# EAGLE design ESP12 Altherma (EAGLE 9.6.2)
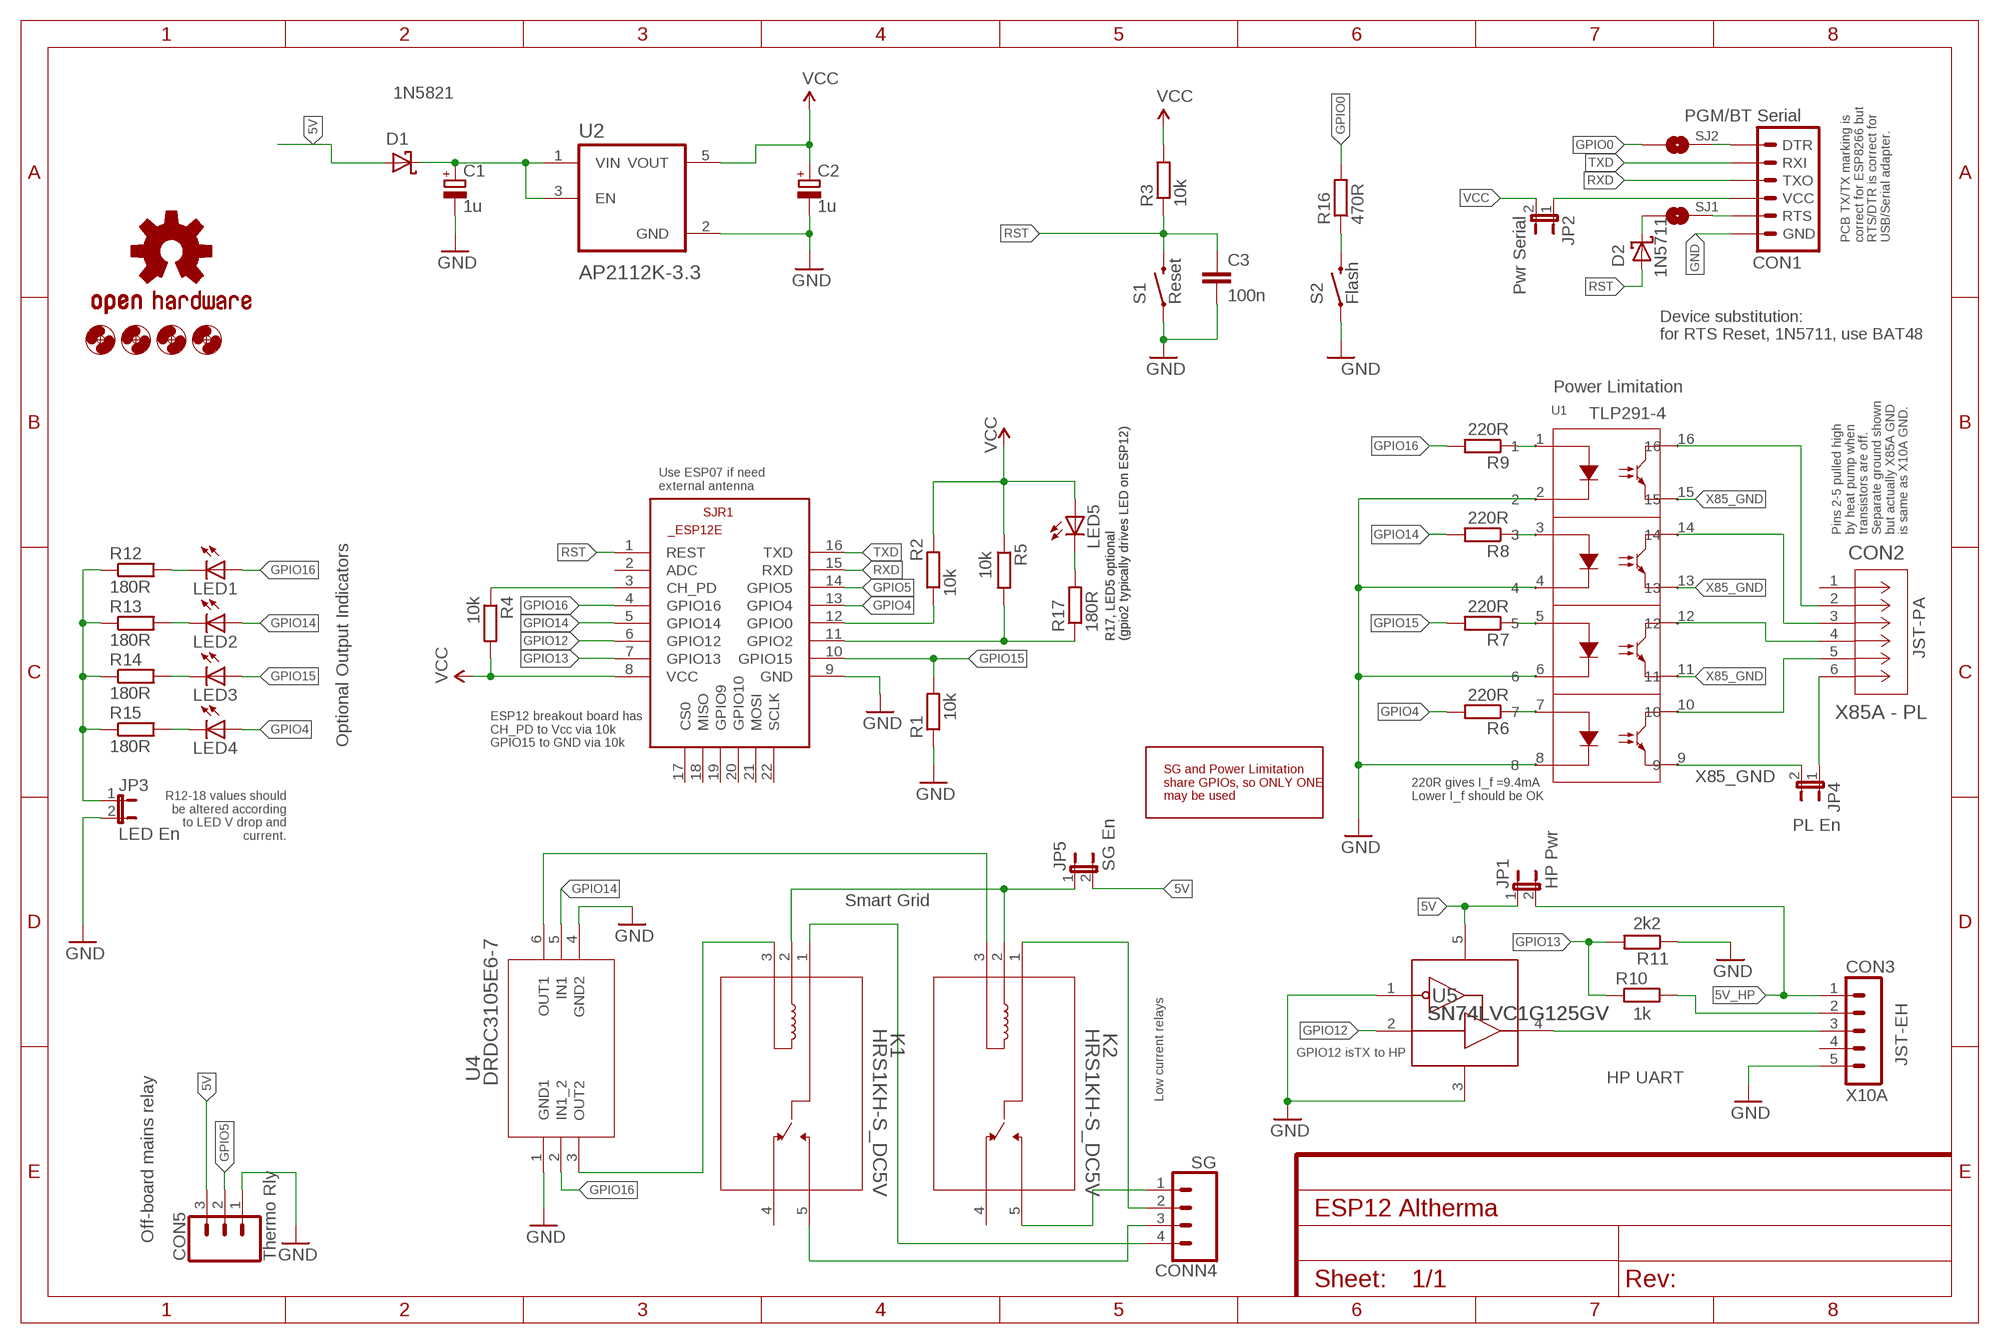
[diagram p0: schematic, sheet 1]

## Parts
C1  1u  CPOL-EUE2.5-5**10UF  [E2,5-5]
C2  1u  CPOL-EUE2.5-5**10UF  [E2,5-5]
C3  100n  C-EU1206  [1206]
CON1  PGM/BT Serial  ESP8266_SERIAL_PROGRAM1X06_ESP_SERIAL  [1X06-KIT]
CON2  X85A - PL  B06B-PASK(LF)(SN)  [CONN_B06B-PASK_JST]
CON3  X10A  B5B-EH-A  [B5B-EH-A]
CON5  Thermo Rly  CONN_03  [1X03]
CONN4  SG  CONN_04PTH  [1X04]
D1  1N5821  DIODE-SCHOTTKYDO-201-VERT  [DO201-15]
D2  1N5711  DIODE-SCHOTTKYDO35-7  [DO35-7]
H1  MOUNT-HOLE3.2  [3,2]
H2  MOUNT-HOLE3.2  [3,2]
H3  MOUNT-HOLE3.2  [3,2]
H4  MOUNT-HOLE3.2  [3,2]
JP1  HP Pwr  JUMPER-2PTH  [1X02]
JP2  Pwr Serial  JUMPER-2PTH  [1X02]
JP3  LED En  JUMPER-2PTH  [1X02]
JP4  PL En  JUMPER-2PTH  [1X02]
JP5  SG En  JUMPER-2PTH  [1X02]
K1  HRS1KH-S_DC5V  [HRS1KH-S_DC5V_MTC]
K2  HRS1KH-S_DC5V  [HRS1KH-S_DC5V_MTC]
LED1  LED1206  [LED-1206]
LED2  LED1206  [LED-1206]
LED3  LED1206  [LED-1206]
LED4  LED1206  [LED-1206]
LED5  LED1206  [LED-1206]
LOGO1  OSHW-LOGOM  [OSHW-LOGO-M]
R1  10k  R-EU_  [1206]
R2  10k  R-EU_  [1206]
R3  10k  R-EU_  [1206]
R4  10k  R-EU_  [1206]
R5  10k  R-EU_  [1206]
R6  220R  R-EU_  [1206]
R7  220R  R-EU_  [1206]
R8  220R  R-EU_  [1206]
R9  220R  R-EU_  [1206]
R10  1k  R-EU_  [1206]
R11  2k2  R-EU_  [1206]
R12  180R  R-EU_  [1206]
R13  180R  R-EU_  [1206]
R14  180R  R-EU_  [1206]
R15  180R  R-EU_  [1206]
R16  470R  R-EU_0204/7**  [0204/7]
R17  180R  R-EU_  [1206]
S1  Reset  SWITCH-MOMENTARY-2PTH  [TACTILE-PTH]
S2  Flash  SWITCH-MOMENTARY-2PTH  [TACTILE-PTH]
SJ1  SOLDERJUMPERTRACE  [SJ_2S-TRACE]
SJ2  SOLDERJUMPERTRACE  [SJ_2S-TRACE]
SJR1  ESP8266-12EESP8266-ESP12E-X  [ESP8266-ESP12E0-NKE]
U1  TLP291-4  TLP291-4(GB-TP,E)  [SO16_TOS]
U2  AP2112K-3.3  AP2112K-3.3TRG1  [SOT95P285X140-5N]
U4  DRDC3105E6-7  DRDC3105E6-7SOT26-DI_DIO-M  [SOT26-DI_DIO-M]
U5  SN74LVC1G125GV  SN74LVC1G125DBVRDBV0005A_L  [DBV0005A_L]

## Nets
5V: CON5.3 D1.A JP1.1 JP5.2 U5.5(VCC)
5V_HP: CON3.1 JP1.2
GND: C1.- C2.- C3.2 CON1.1(GND) CON3.5 CON5.1 JP3.2 R1.1 R11.1 S1.1 S2.1 SJR1.9(GND) U1.2 U1.4 U1.6 U1.8 U2.2(GND) U4.1(GND1) U4.4(GND2) U5.1(OE_N) U5.3(GND)
GPIO0: R2.1 R16.2 SJ2.1 SJR1.12(GPIO0)
GPIO2: R5.2 R17.1 SJR1.11(GPIO2)
GPIO4: LED4.A R6.2 SJR1.13(GPIO4)
GPIO5: CON5.2 SJR1.14(GPIO5)
GPIO12: SJR1.6(GPIO12) U5.2(A)
GPIO13: R10.1 R11.2 SJR1.7(GPIO13)
GPIO14: LED2.A R8.2 SJR1.5(GPIO14) U4.5(IN1)
GPIO15: LED3.A R1.2 R7.2 SJR1.10(GPIO15)
GPIO16: LED1.A R9.2 SJR1.4(GPIO16) U4.2(IN1_2)
N$1: R16.1 S2.3
N$2: R9.1 U1.1
N$3: CON2.3 U1.14
N$4: JP3.1 R12.1 R13.1 R14.1 R15.1
N$5: CON1.2(RTS) SJ1.2
N$6: JP5.1 K1.2 K2.2
N$7: LED3.C R14.2
N$8: C1.+ D1.C U2.1(VIN) U2.3(EN)
N$9: CON1.3(VCC) JP2.1
N$10: CON1.6(DTR) SJ2.2
N$11: CON2.5 U1.10
N$12: CON2.4 U1.12
N$13: CON2.2 U1.16
N$14: D2.C SJ1.1
N$15: LED4.C R15.2
N$16: R4.1 SJR1.3(CH_PD)
N$17: R6.1 U1.7
N$18: R8.1 U1.3
N$19: R7.1 U1.5
N$20: CON3.3 U5.4(Y)
N$21: CON3.2 R10.2
N$22: CONN4.1 K2.5
N$23: CONN4.2 K2.1
N$24: CONN4.3 K1.5
N$25: CONN4.4 K1.1
N$26: K1.3 U4.3(OUT2)
N$27: CON2.6 JP4.1
N$28: LED5.C R17.2
N$29: K2.3 U4.6(OUT1)
N$39: LED1.C R12.2
N$40: LED2.C R13.2
RST: C3.1 D2.A R3.1 S1.3 SJR1.1(REST)
RXD: CON1.4(TXO) SJR1.15(RXD)
TXD: CON1.5(RXI) SJR1.16(TXD)
VCC: C2.+ JP2.2 LED5.A R2.2 R3.2 R4.2 R5.1 SJR1.8(VCC) U2.5(VOUT)
X85_GND: JP4.2 U1.9 U1.11 U1.13 U1.15
Unconnected: CON2.1 CON3.4 K1.4 K2.4 SJR1.2(ADC) SJR1.17(CS0) SJR1.18(MISO) SJR1.19(GPIO9) SJR1.20(GPIO10) SJR1.21(MOSI) SJR1.22(SCLK)

## Notes on the sheet
- PCB TX/TX marking is
  correct for ESP8266 but
  RTS/DTR is correct for
  USB/Serial adapter.
- Device substitution:
  for RTS Reset, 1N5711, use BAT48
- Power Limitation
- TLP291-4
- Use ESP07 if need
  external antenna
- Pins 2-5 pulled high
  by heat pump when
  transistors are off.
  Separate ground shown
  but actually X85A GND
  is same as X10A GND.
- R17, LED5 optional
  (gpio2 typically drives LED on ESP12)
- R17, LED5 optional
  (gpio2 typically drives LED on ESP12)
- JST-PA
- Optional Output Indicators
- ESP12 breakout board has
  CH_PD to Vcc via 10k
  GPIO15 to GND via 10k
- R12-18 values should
  be altered according
  to LED V drop and
  current.
- SG and Power Limitation
  share GPIOs, so ONLY ONE
  may be used
- 220R gives I_f =9.4mA
  Lower I_f should be OK
- Smart Grid
- GPIO12 isTX to HP
- JST-EH
- HP UART
- Low current relays
- Off-board mains relay

## Library data of the parts
C1 C2 = Master 2016:CPOL-EU: POLARIZED CAPACITOR, European symbol
C3 = Master 2016:C-EU: CAPACITOR, European symbol
CON1 = Master 2016:ESP8266_SERIAL_PROGRAM
CON2 = conn-jst-pa6:B06B-PASK(LF)(SN); COPYRIGHT: Copyright (C) 2025 Ultra Librarian. All rights reserved.; MANUFACTURER_PART_NUMBER: B06B-PASK(LF)(SN); MFR_NAME: JST
CON3 = con-jst-eh:B5B-EH-A: HEADER
CON5 = SparkFun-Connectors:CONN_03: Multi connection point. Often used as Generic Header-pin footprint for 0.1 inch spaced/style header connections On any of the 0.1 inch spaced packages, you can populate with these: Break Away Headers - Straight <https://www.sparkfun.com/products/116> (PRT-00116) Break Away Male Headers - Right Angle <https://www.sparkfun.com/products/553> (PRT-00553) Female Headers <https://www.sparkfun.com/products/115> (PRT-00115) Break Away Headers - Machine Pin <https://www.sparkfun.com/products/117> (PRT-00117) Break Away Female Headers - Swiss Machine Pin <https://www.sparkfun.com/products/743> (PRT-00743) Stackable Header - 3 Pin (Female, 0.1") <https://www.sparkfun.com/products/13875> (PRT-13875) For SCREWTERMINALS and SPRING TERMINALS visit here: Screw Terimnals on SparkFun.com <https://www.sparkfun.com/search/results?term=Screw+Terminals> (5mm/3.5mm/2.54mm spacing) This device is also useful as a general connection point to wire up your design to another part of your project. Our various solder wires solder well into these plated through hole pads. Hook-Up Wire - Assortment (Stranded, 22 AWG) <https://www.sparkfun.com/products/11375> (PRT-11375) Hook-Up Wire - Assortment (Solid Core, 22 AWG) <https://www.sparkfun.com/products/11367> (PRT-11367) View the entire wire category on our website here <https://www.sparkfun.com/categories/141> Special notes: Molex polarized connector foot print use with SKU : PRT-08232 with associated crimp pins and housings.; PROD_ID: XXX-00000; VALUE: 455-1750-1-ND
CONN4 = SparkFun-Connectors:CONN_04: Multi connection point. Often used as Generic Header-pin footprint for 0.1 inch spaced/style header connections On any of the 0.1 inch spaced packages, you can populate with these: Break Away Headers - Straight <https://www.sparkfun.com/products/116> (PRT-00116) Break Away Male Headers - Right Angle <https://www.sparkfun.com/products/553> (PRT-00553) Female Headers <https://www.sparkfun.com/products/115> (PRT-00115) Break Away Headers - Machine Pin <https://www.sparkfun.com/products/117> (PRT-00117) Break Away Female Headers - Swiss Machine Pin <https://www.sparkfun.com/products/743> (PRT-00743) For SCREWTERMINALS and SPRING TERMINALS visit here: Screw Terimnals on SparkFun.com <https://www.sparkfun.com/search/results?term=Screw+Terminals> (5mm/3.5mm/2.54mm spacing) This device is also useful as a general connection point to wire up your design to another part of your project. Our various solder wires solder well into these plated through hole pads. Hook-Up Wire - Assortment (Stranded, 22 AWG) <https://www.sparkfun.com/products/11375> (PRT-11375) Hook-Up Wire - Assortment (Solid Core, 22 AWG) <https://www.sparkfun.com/products/11367> (PRT-11367) View the entire wire category on our website here <https://www.sparkfun.com/categories/141> Special notes: Molex polarized connector foot print use with SKU : PRT-08231 with associated crimp pins and housings. 1MM SMD Version SKU: PRT-10208; PROD_ID: CONN-09696
D1 D2 = Master 2016:DIODE-SCHOTTKY: DIODE high speed (Philips)
H1-H4 = Master 2016:MOUNT-HOLE: MOUNTING HOLE with drill center marker
JP1-JP5 = SparkFun-Passives:JUMPER-2: Jumper Basic 0.1" spaced jumper. Use with breakaway headers.
K1 K2 = HRS1KH-S Relay:HRS1KH-S_DC5V; COPYRIGHT: Copyright (C) 2024 Ultra Librarian. All rights reserved.; MANUFACTURER_PART_NUMBER: HRS1KH-S DC5V; MFR_NAME: Multicomp
LED1-LED5 = Master 2016:LED: LEDs Standard schematic elements and footprints for 5mm, 3mm, 1206, and 0603 sized LEDs. 5mm - Spark Fun Electronics SKU : COM-00529 (and others)
LOGO1 = Master 2016:OSHW-LOGO: Open Source Hardware Logo This logo indicates the piece of hardware it is found on incorporates a OSHW license and/or adheres to the definition of open source hardware found here: http://freedomdefined.org/OSHW
R1-R17 = Master 2016:R-EU_: RESISTOR, European symbol
S1 S2 = Master 2016:SWITCH-MOMENTARY-2: Various NO switches- pushbuttons, reed, etc
SJ1 SJ2 = Master 2016:SOLDERJUMPER: Solder Jumper Standard SMD solder jumper. Used to automate production. Two varients : Normally Open and Normally Closed are the same, but have different paste layers. NC will have a large amount of paste and should jumper during reflow.
SJR1 = esp12e:ESP8266-12E: ESP8266-12E Library for Eagle CAD The author not responsible for any damages or errors!. Created by Suhail jr.lt;/author>
U1 = TLP291-4:TLP291-4(GB-TP,E); COPYRIGHT: Copyright (C) 2024 Ultra Librarian. All rights reserved.; MANUFACTURER_PART_NUMBER: TLP291-4(GB-TP,E); MFR_NAME: Toshiba Electronic Devices & Storage Corp.
U2 = AP2112K-3.3TRG1:AP2112K-3.3TRG1: AP2112 Series 0.6 A 3.3 V Fixed Output SMT LDO Linear Regulator - SOT23-5; AVAILABILITY: Unavailable; DESCRIPTION: Linear Voltage Regulator IC 1 Output 600mA SOT-25; MF: Diodes Inc.; MP: AP2112K-3.3TRG1; PACKAGE: SOT-753 Diodes Inc.; PRICE: None
U4 = DRDC3105E6:DRDC3105E6-7; COPYRIGHT: Copyright (C) 2024 Ultra Librarian. All rights reserved.; MANUFACTURER_PART_NUMBER: DRDC3105E6-7; MFR_NAME: Diodes Inc
U5 = 74LVC1G125GV:SN74LVC1G125DBVR; COPYRIGHT: Copyright (C) 2024 Ultra Librarian. All rights reserved.; MANUFACTURER_PART_NUMBER: SN74LVC1G125DBVR; MFR_NAME: Texas Instruments; REFDES: RefDes; TYPE: TYPE

## Board
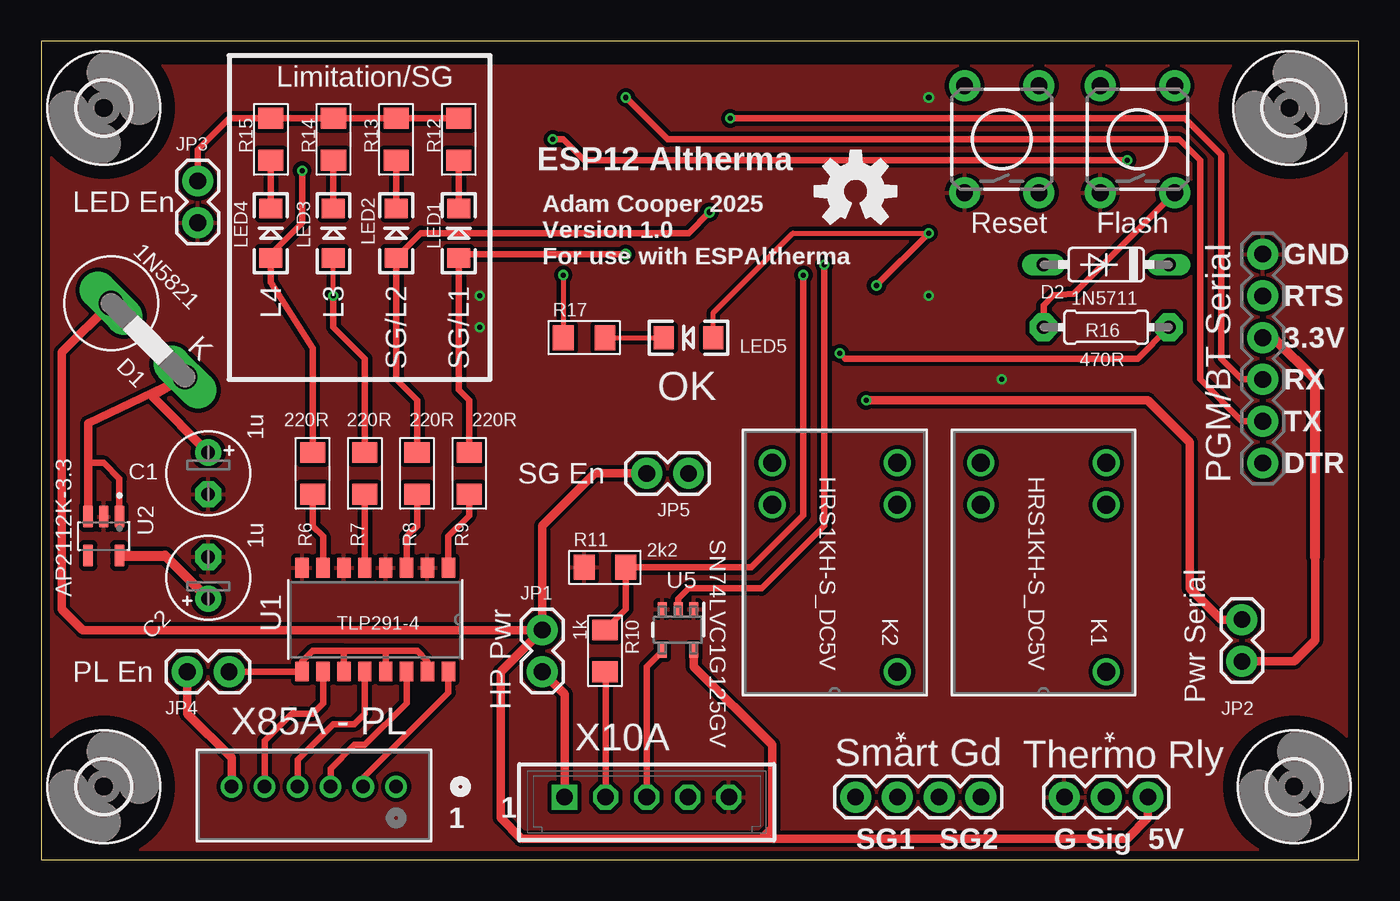
[diagram p1: board, top side]
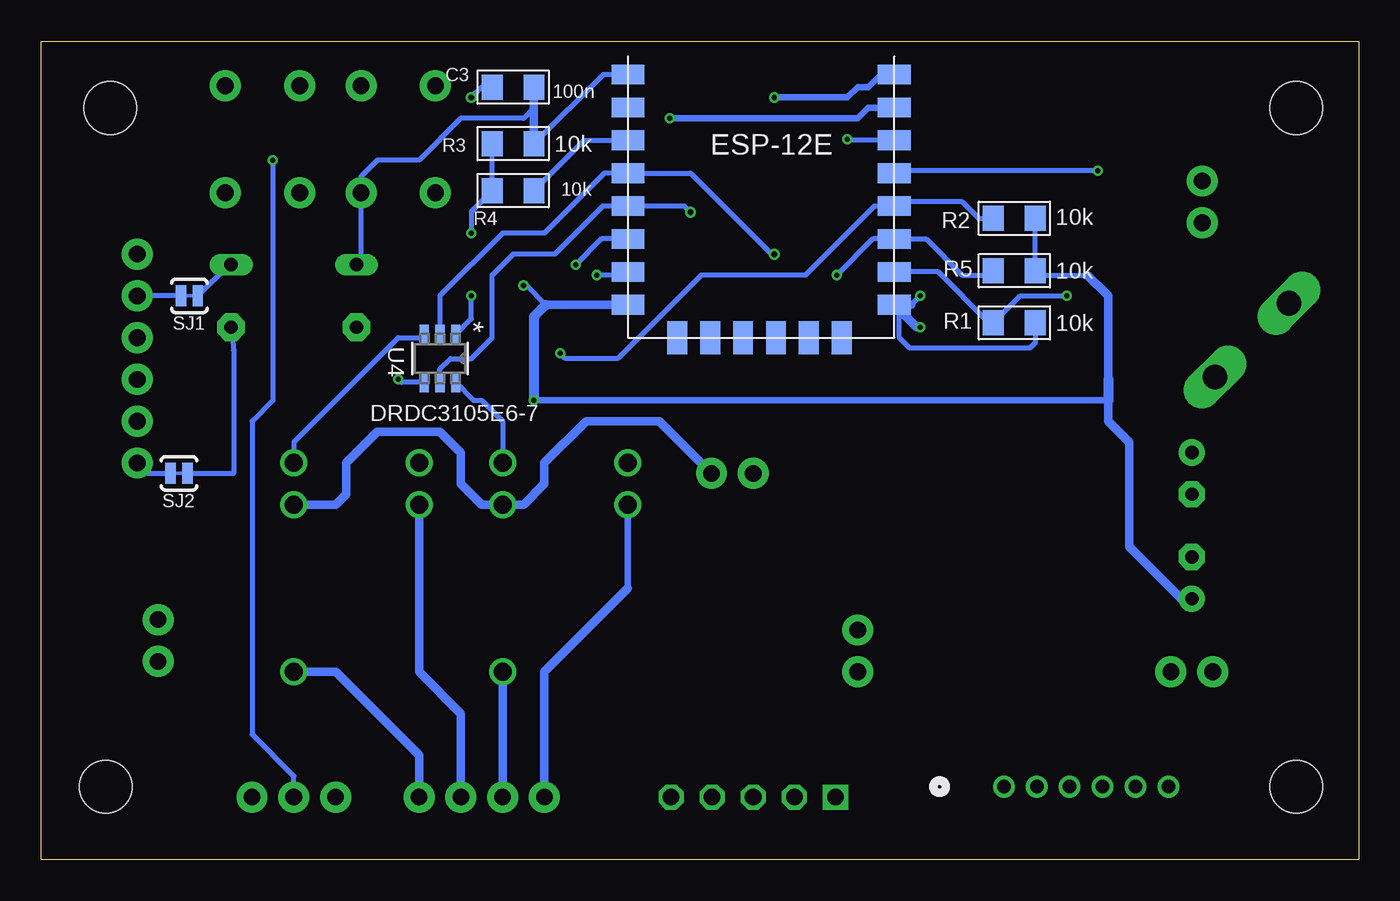
[diagram p2: board, bottom side, seen from below]

Size 80.14 x 49.78 mm. Coordinates in mm from the lower left corner, seen from the top.
Outline: 0,0 80.14,0 80.14,49.78 0,49.78 0,0
Copper layers (1*16): Top 0.035mm / dielectric 1.5mm / Bottom 0.035mm
Design rules "Seeed Fusion_eagle_rule_v1.1": minimum track width 6mil, minimum drill 12mil, track to track 6mil, track to pad 6mil, pad to pad 6mil, via to via 6mil, smd to smd 0mil, copper to edge 10mil, drill to drill 10mil, minimum pad ring 10mil, minimum via ring 6mil, stop-mask expansion 2mil, vias tented up to drill 100mil, thermal gap 10mil

### Footprints (pad centres in the part's own frame; a part is rotated, then mirrored left to right if it is on the bottom)
E2,5-5 = drill 0.813 pad 1.6: + -1.27,0 | drill 0.813 pad 1.6 octagon: - 1.27,0
1206 = smd 1.27 x 1.524: 1 -1.27,0; 2 1.27,0
1X06-KIT = drill 1.016 pad 1.88: 1 0,0; 2 2.54,0; 3 5.08,0; 4 7.62,0; 5 10.16,0; 6 12.7,0
CONN_B06B-PASK_JST = drill 0.813 pad 1.321: 1 0,0; 2 2.007,0; 3 3.988,0; 4 5.994,0; 5 8.001,0; 6 10.008,0
B5B-EH-A = drill 1.016 square: 1 -5,0 | drill 1.016 octagon: 2 -2.5,0; 3 0,0; 4 2.5,0; 5 5,0
1X03 = drill 1.016 pad 1.88: 1 0,0; 2 2.54,0; 3 5.08,0
1X04 = drill 1.016 pad 1.88: 1 0,0; 2 2.54,0; 3 5.08,0; 4 7.62,0
DO201-15 = drill 1.499 long: A 0,0; C -6.35,0
DO35-7 = drill 0.813 long: A 3.81,0; C -3.81,0
3,2 = hole 3.2: 0,0
1X02 = drill 1.016 pad 1.88: 1 0,0; 2 2.54,0
HRS1KH-S_DC5V_MTC = drill 1.092 pad 1.6: 1 0,0; 2 0,-10.16; 3 0,-12.7; 4 7.62,-12.7; 5 7.62,-10.16
LED-1206 = smd 1.2 x 1.4: A -1.5,0; C 1.5,0
0204/7 = drill 0.813 pad 1.676 octagon: 1 -3.81,0; 2 3.81,0
TACTILE-PTH = drill 1.016 pad 1.88: 1 -3.251,2.261; 2 3.251,2.261; 3 -3.251,-2.261; 4 3.251,-2.261
SJ_2S-TRACE = smd 0.635 x 1.27: 1 -0.508,0; 2 0.508,0
ESP8266-ESP12E0-NKE = smd 2 x 1.2: 1 -7.62,5.84; 2 -7.62,3.84; 3 -7.62,1.84; 4 -7.62,-0.16; 5 -7.62,-2.16; 6 -7.62,-4.16; 7 -7.62,-6.16; 8 -7.62,-8.16; 9 8.58,-8.16; 10 8.58,-6.16; 11 8.58,-4.16; 12 8.58,-2.16; 13 8.58,-0.16; 14 8.58,1.84; 15 8.58,3.84; 16 8.58,5.84 | smd 1.2 x 2: 17 -4.62,-10.16; 18 -2.62,-10.16; 19 -0.62,-10.16; 20 1.38,-10.16; 21 3.38,-10.16; 22 5.38,-10.16
SO16_TOS = smd 1.194 x 0.813: 1 -3.15,4.445; 2 -3.15,3.175; 3 -3.15,1.905; 4 -3.15,0.635; 5 -3.15,-0.635; 6 -3.15,-1.905; 7 -3.15,-3.175; 8 -3.15,-4.445; 9 3.15,-4.445; 10 3.15,-3.175; 11 3.15,-1.905; 12 3.15,-0.635; 13 3.15,0.635; 14 3.15,1.905; 15 3.15,3.175; 16 3.15,4.445
SOT95P285X140-5N = smd 1.35 x 0.6: 1 -1.185,0.95; 2 -1.185,0; 3 -1.185,-0.95; 4 1.185,-0.95; 5 1.185,0.95
SOT26-DI_DIO-M = smd 1.206 x 0.559: 1 -1.454,0.95; 2 -1.454,0; 3 -1.454,-0.95; 4 1.454,-0.95; 5 1.454,0; 6 1.454,0.95
DBV0005A_L = smd 0.8 x 0.55: 1 -1.275,0.95; 2 -1.275,0; 3 -1.275,-0.95; 4 1.275,-0.95; 5 1.275,0.95

### Placement (x,y rotation side)
C1  10.16,23.5 270 top
C2  10.16,17.14 90 top
C3  51.44,46.99 180 bottom
CON1  74.3,36.83 270 top
CON2  21.59,4.45 180 top
CON3  36.83,3.81 0 top
CON5  62.23,3.81 0 top
CONN4  49.53,3.81 0 top
D1  4.26,33.84 135 top
D2  64.77,36.2 180 top
H1  75.93,45.72 0 top
H2  3.81,4.45 0 top
H3  76.2,4.45 0 top
H4  3.81,45.72 0 top
JP1  30.48,13.97 270 top
JP2  73.03,12.06 90 top
JP3  9.53,41.27 270 top
JP4  8.89,11.43 0 top
JP5  39.37,23.5 180 top
K1  64.77,11.43 180 top
K2  52.07,11.43 180 top
LED1  25.4,38.1 90 top
LED2  21.59,38.1 90 top
LED3  17.78,38.1 90 top
LED4  13.97,38.1 90 top
LED5  39.37,31.75 180 top
LOGO1  49.53,40.64 0 top
R1  20.95,32.66 180 bottom
R2  20.95,39.01 0 bottom
R3  51.44,43.55 180 bottom
R4  51.44,40.69 180 bottom
R5  20.95,35.83 180 bottom
R6  16.51,23.5 90 top
R7  19.68,23.5 90 top
R8  22.86,23.5 90 top
R9  26.04,23.5 90 top
R10  34.29,12.7 270 top
R11  34.29,17.78 0 top
R12  25.4,43.81 270 top
R13  21.59,43.81 270 top
R14  17.78,43.81 270 top
R15  13.97,43.81 270 top
R16  64.77,32.38 0 top
R17  33.02,31.75 0 top
S1  58.42,43.81 90 top
S2  66.67,43.81 90 top
SJ1  71.12,34.29 180 bottom
SJ2  71.75,23.5 180 bottom
SJR1  36.83,41.91 0 bottom
U1  20.32,14.61 270 top
U2  3.81,19.68 270 top
U4  55.88,30.48 270 bottom
U5  38.73,13.97 270 top

### Tracks (layer width: path | path; a pad name or v marks a point on that pad's centre or on a via)
5V
  Top 0.508: JP1.1 2.54,13.97 1.27,15.24 1.27,30.85 D1.A | JP1.1 27.94,11.43 27.94,2.54 29.21,1.27 43.81,1.27 | 43.81,1.27 44.45,1.91 44.45,6.99 39.69,11.75 U5.5 | 43.81,1.27 66.04,1.27 67.31,2.54 CON5.3 | JP1.1 30.48,20.32 33.66,23.5 JP5.2
5V_HP
  Top 0.508: CON3.1 31.83,10.08 JP1.2
GND  (via drill 0.3 pad 0.61, 0.35)
  Bottom 0.305: SJR1.9 27.94,33.75 27.94,31.75 27.3,31.11 20,31.11 19.68,31.43 R1.1 | 27.21,33.75 v26.67,34.29 | 26.89,32.38 v26.67,32.38 | U4.1 53.98,32.89 v53.98,34.29 | U4.4 58.24,29.03 v58.42,29.21 | C3.2 53.34,46.99 v53.98,46.35
  Bottom 0.508: 27.94,33.75 27.21,33.75 | SJR1.9 26.89,32.38
  pour Top (isolate 0.254): 0.64,0.64 0.64,48.26 79.38,48.26 79.38,0.64
GPIO0  (via drill 0.3 pad 0.61)
  Top 0.305: v48.58,30.8 48.9,30.48
  Top 0.406: R16.2 66.67,30.48 48.9,30.48
  Bottom 0.305: R2.1 23.13,39.01 24.13,40.01 28,40.01 SJR1.12 29.46,39.75 30.8,38.42 31.11,38.1 33.66,35.56 40.01,35.56 45.09,30.48 48.26,30.48 v48.58,30.8 | R16.2 68.43,30.96 68.43,23.5 SJ2.1
GPIO2  (via drill 0.3 pad 0.61)
  Top 0.305: v31.75,35.56 R17.1
  Bottom 0.305: R5.2 22.5,35.56 24.13,35.56 26.32,37.75 SJR1.11 29.56,37.75 v31.75,35.56
GPIO4  (via drill 0.3 pad 0.61)
  Top 0.305: 13.97,36.83 LED4.A
  Top 0.406: v15.88,41.91 15.88,38.73 13.97,36.83 | R6.2 16.51,31.11 13.97,35.11 LED4.A
  Bottom 0.305: v15.88,41.91 28.09,41.91 SJR1.13
GPIO5  (via drill 0.3 pad 0.61)
  Top 0.406: v31.11,43.81 31.75,43.81 33.02,42.55 v66.04,42.55
  Bottom 0.305: SJR1.14 31.18,43.75 v31.11,43.81 | v66.04,42.55 66.04,27.94 67.31,26.67 67.31,7.62 64.77,5.08 CON5.2
GPIO12  (via drill 0.3 pad 0.61)
  Top 0.406: U5.2 38.73,15.88 39.37,16.51 43.81,16.51 47.62,20.32 v47.62,36.2
  Bottom 0.305: SJR1.6 46.07,37.75 v47.62,36.2
GPIO13  (via drill 0.3 pad 0.61)
  Top 0.406: R10.1 35.56,15.24 R11.2 43.18,17.78 46.35,20.95 v46.35,35.56
  Bottom 0.305: SJR1.7 44.64,35.56 v46.35,35.56
GPIO14  (via drill 0.35)
  Top 0.406: R8.2 22.86,27.94 21.59,29.21 LED2.A 23.09,38.1 39.37,38.1 v40.64,39.37
  Bottom 0.305: U4.5 55.88,29.84 55.24,30.48 53.98,30.48 52.7,31.75 52.7,35.56 51.44,36.83 48.9,36.83 46.35,39.37 46.04,39.69 45.98,39.75 SJR1.5 41.02,39.75 v40.64,39.37
GPIO15  (via drill 0.3 pad 0.61)
  Top 0.305: v17.78,34.29 LED3.A
  Top 0.406: R7.2 19.68,30.48 17.78,32.38 v17.78,34.29
  Bottom 0.305: SJR1.10 25.59,35.75 22.5,32.66 R1.2 20.59,34.29 v17.78,34.29
GPIO16  (via drill 0.35)
  Top 0.305: LED1.A 25.63,36.83
  Top 0.406: 25.63,36.83 v35.56,36.83 | R9.2 26.04,27.94 25.4,28.57 LED1.A
  Bottom 0.305: U4.2 55.88,34.29 52.07,38.1 49.53,38.1 45.88,41.75 SJR1.4 40.64,41.75 35.72,36.83 v35.56,36.83
N$1
  Top 0.406: R16.1 60.96,33.72 61.56,34.32 62.8,34.43 S2.3
N$2
  Top 0.406: R9.1 26.04,20.93 24.77,19.66 U1.1
N$3
  Top 0.406: CON2.3 17.6,5.54 19.05,6.99 19.68,6.99 22.23,9.53 U1.14
N$4
  Top 0.406: JP3.1 9.53,43.18 11.43,45.09 R15.1 R14.1 R13.1 R12.1
N$5
  Bottom 0.305: SJ1.2 CON1.2
N$6
  Bottom 0.508: JP5.1 42.55,26.67 46.99,26.67 49.53,24.13 49.53,22.86 50.8,21.59 K2.2 53.34,21.59 54.61,22.86 54.61,24.77 55.88,26.04 59.69,26.04 61.59,24.13 61.59,22.23 62.23,21.59 K1.2
N$7
  Top 0.406: R14.2 LED3.C
N$8
  Top 0.406: U2.1 4.76,23.18 3.81,24.13 2.86,24.13
  Top 0.508: U2.3 2.86,24.13 2.86,26.55 D1.C 6.75,28.18 C1.+
N$9
  Top 0.305: CON1.3 74.93,31.75
  Top 0.508: JP2.1 76.2,12.06 77.47,13.34 77.47,18.41
  Top 0.61: 74.93,31.75 77.47,29.21 77.47,18.41
N$10
  Bottom 0.305: CON1.6 73.66,23.5 SJ2.2
N$11
  Top 0.406: CON2.5 13.59,7.24 15.24,8.89 16.51,8.89 17.14,9.53 U1.10
N$12
  Top 0.406: CON2.4 15.6,6.07 17.78,8.26 19.05,8.26 19.68,8.89 U1.12
N$13
  Top 0.305: CON2.2 19.58,4.98
  Top 0.406: 19.58,4.98 24.77,10.16 U1.16
N$14
  Bottom 0.305: SJ1.1 68.71,36.2 D2.C
N$15
  Top 0.406: R15.2 LED4.C
N$16
  Bottom 0.305: R4.1 47.1,43.75 SJR1.3
N$17
  Top 0.406: R6.1 16.51,20.3 17.14,19.66 U1.7
N$18
  Top 0.406: R8.1 22.86,20.3 22.23,19.66 U1.3
N$19
  Top 0.406: R7.1 U1.5
N$20
  Top 0.406: U5.4 36.83,11.74 CON3.3
N$21
  Top 0.305: 34.33,11.39 R10.2
  Top 0.406: CON3.2 34.33,11.39
N$22
  Bottom 0.406: 44.45,16.51 K2.5
  Bottom 0.508: 44.45,16.51 49.53,11.43 CONN4.1
N$23
  Bottom 0.508: K2.1 CONN4.2
N$24
  Bottom 0.508: K1.5 57.15,11.43 54.61,8.89 CONN4.3
N$25
  Bottom 0.508: K1.1 62.23,11.43 57.15,6.35 CONN4.4
N$26
  Bottom 0.305: K1.3 64.77,25.4 58.42,31.75 57.01,31.75 U4.3
N$27
  Top 0.508: JP4.1 8.89,8.89 11.58,6.2 CON2.6
N$28
  Top 0.305: R17.2 LED5.C
N$29
  Bottom 0.305: U4.6 53.84,27.94 53.34,27.94 52.07,26.67 K2.3
N$39
  Top 0.406: R12.2 LED1.C
N$40
  Top 0.406: R13.2 LED2.C
RST
  Bottom 0.305: SJR1.1 45.96,47.75 R3.1 | 50.16,45.72 50.8,45.09 54.61,45.09 57.15,42.55 59.69,42.55 60.68,41.55 S1.3 60.68,36.47 D2.A
  Bottom 0.508: C3.1 50.16,45.72 R3.1
RXD  (via drill 0.3 pad 0.61)
  Top 0.406: v41.91,45.09 69.53,45.09 71.75,42.86 71.75,30.48 73.03,29.21 CON1.4
  Bottom 0.305: SJR1.15 28.28,45.72
  Bottom 0.406: 28.28,45.72 29.84,45.72 30.48,45.09 v41.91,45.09
TXD  (via drill 0.3 pad 0.61)
  Top 0.406: CON1.5 73.03,26.67 70.48,29.21 70.48,42.55 69.22,43.81 38.1,43.81 v35.56,46.35
  Bottom 0.305: 29.09,47.75 SJR1.16
  Bottom 0.406: v35.56,46.35 31.11,46.35 30.48,46.99 29.84,46.99 29.09,47.75
VCC  (via drill 0.3 pad 0.61, 0.35)
  Top 0.305: LED5.A 40.87,33.25 45.72,38.1 v53.98,38.1
  Top 0.406: v50.8,34.92 v53.98,38.1
  Top 0.508: v50.16,27.94 67.31,27.94 69.85,25.4 69.85,16.51 71.75,14.61 JP2.2
  Top 0.61: C2.+ 7.54,18.5 U2.5
  Bottom 0.305: 16.51,35.56 19.41,35.56 R5.1 R2.2 | R3.2 R4.2 53.98,39.42 v53.98,38.1 | 49.44,33.75 50.61,34.92 v50.8,34.92
  Bottom 0.406: v50.16,27.94 15.24,27.94
  Bottom 0.508: 16.51,35.56 15.24,34.29 15.24,29.21 | SJR1.8 49.44,33.75 | 15.24,27.94 15.24,26.67 13.97,25.4 13.97,19.05 10.79,15.88 C2.+
  Bottom 0.61: 15.24,29.21 15.24,27.94 | v50.16,27.94 50.16,33.02 49.44,33.75
X85_GND
  Top 0.305: U1.15 23.5,12.06 | 15.85,11.43 U1.9 15.88,12.06
  Top 0.406: 18.41,12.7 16.51,12.7 15.88,12.06 | 18.41,12.7 20.95,12.7 | 20.95,12.7 22.86,12.7 23.5,12.06 | U1.13 20.95,12.7 | U1.11 18.41,12.7 | 15.85,11.43 JP4.2

### Text on the board
tPlace: Limitation/SG | ESP12 Altherma | GND | Adam Cooper 2025 / Version 1.0 / For use with ESPAltherma | L4 | L3 | SG/L2 | SG/L1 | RTS | 3.3V | RX | OK | TX | DTR | Smart Gd | 1 | 1 | SG1 | SG2 | G | Sig | 5V